# Altium schematic sheet TE0888.SchDoc: DIPSY EPT
size A4; Organization: Trenz Electronic GmbH; DocumentNumber: TE0888; Revision: 02; SheetNumber: 1; SheetTotal: 5; Date: 2015-07-17; CompanyName: Trenz Electronic GmbH; ProjectName: TE0888
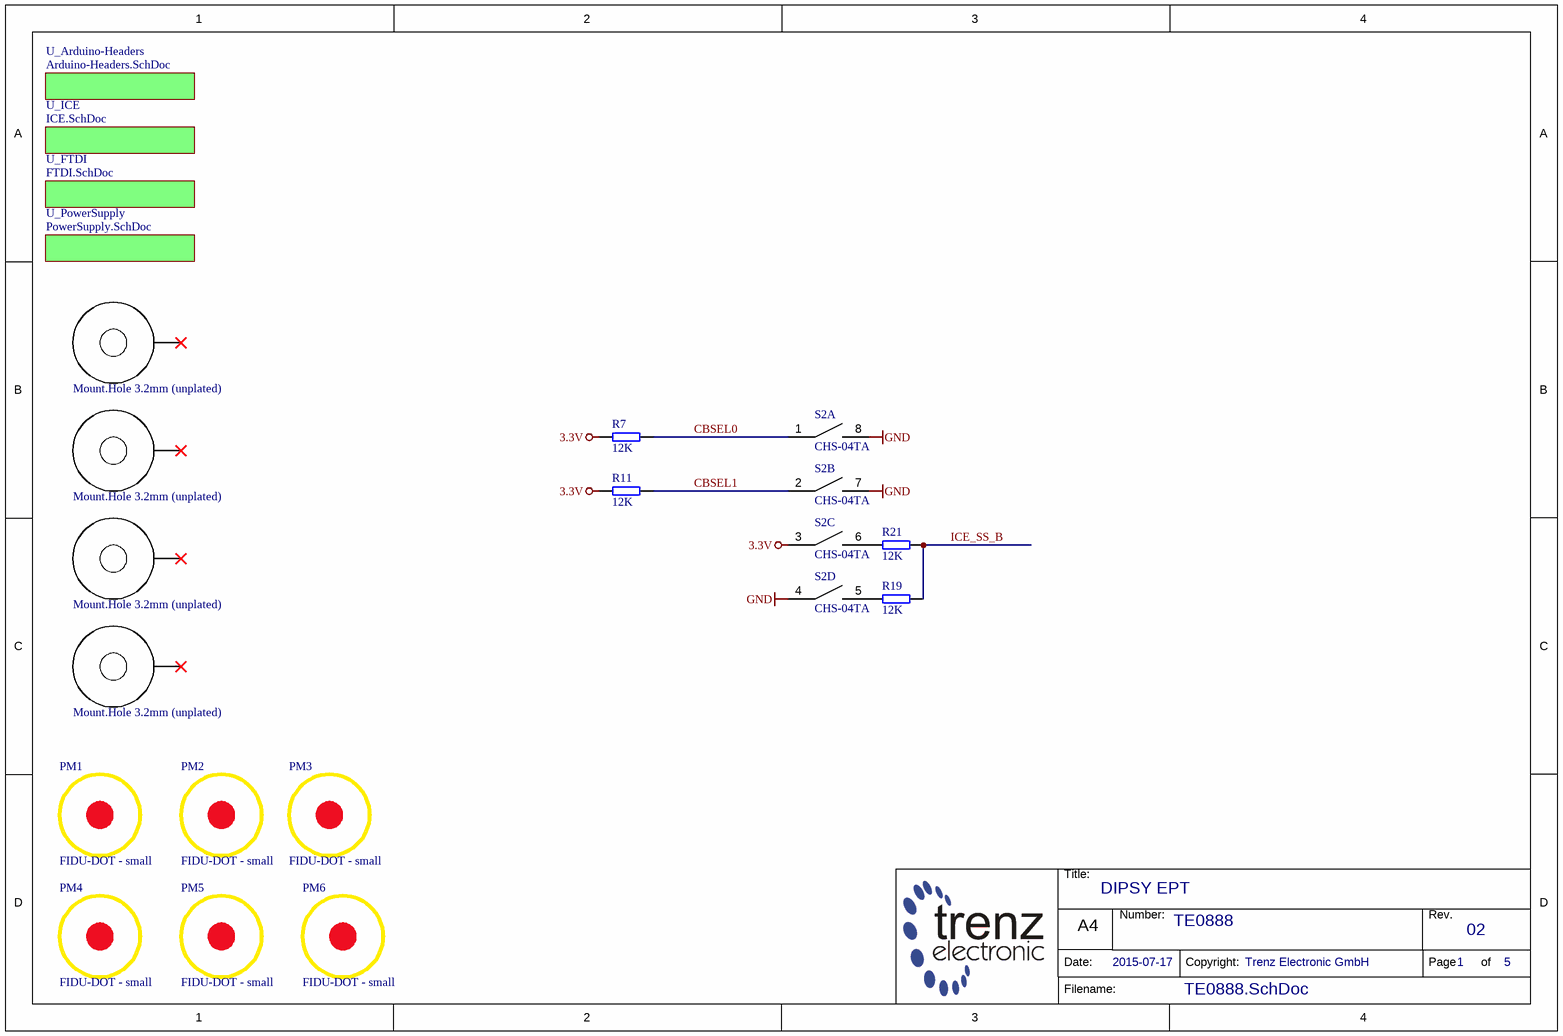
[diagram p0: TE0888.SchDoc]

## Parts
H1  Mount.Hole 3.2mm (unplated)  [MHole3_2mm-UNPLATED]  (no BOM)
H2  Mount.Hole 3.2mm (unplated)  [MHole3_2mm-UNPLATED]  (no BOM)
H3  Mount.Hole 3.2mm (unplated)  [MHole3_2mm-UNPLATED]  (no BOM)
H4  Mount.Hole 3.2mm (unplated)  [MHole3_2mm-UNPLATED]  (no BOM)
PM1  FIDU-DOT - small  [FIDU-DOT - small]
PM2  FIDU-DOT - small  [FIDU-DOT - small]
PM3  FIDU-DOT - small  [FIDU-DOT - small]
PM4  FIDU-DOT - small  [FIDU-DOT - small]
PM5  FIDU-DOT - small  [FIDU-DOT - small]
PM6  FIDU-DOT - small  [FIDU-DOT - small]
R7  12K  [RESC1005X40N]
R11  12K  [RESC1005X40N]
R19  12K  [RESC1005X40N]
R21  12K  [RESC1005X40N]
S2  CHS-04TA  [CHS-04TA]  (parts A,B,C,D of 4)

## Sub-sheets
U_Arduino-Headers = Arduino-Headers.SchDoc: no entries
U_FTDI = FTDI.SchDoc: no entries
U_ICE = ICE.SchDoc: no entries
U_PowerSupply = PowerSupply.SchDoc: no entries

## Nets
3.3V: R7.2 R11.2 S2.3
GND: S2.4 S2.7 S2.8
CBSEL0: R7.1 S2.1
CBSEL1: R11.1 S2.2
ICE_SS_B: R19.1 R21.1
NetR19_2: R19.2 S2.5
NetR21_2: R21.2 S2.6

Not connected (* = marked no-connect by the designer): H1 1*; H2 1*; H3 1*; H4 1*

## Notes on the sheet
- Title:
- Number:
- Rev.
- Date:
- A4
- Copyright:
- Page
- of
- Filename:

## Library data of the parts
H1-H4 = 24910: AN: 24910; Mixed: THT
PM1-PM6 = 22905: AN: 22905; Mixed: FIDU
R7 R11 R19 R21 = 22598: WID SMD 12K 1% 0,063W; AN: 22598; Mixed: SMT; Preferred: Yes; Case: 1005 (0402); Value: 12K
S2 = 23417: DIP Schalter 4 fach 1,27mm SMD; AN: 23417; Mixed: SMT; Trenz-Stock: Yes; HelpURL: B:\AD\adlib\datasheet\CHS; Preferred: Yes